# EAGLE design ANEMOMETRO_REED_SWITCH (EAGLE 9.6.2)
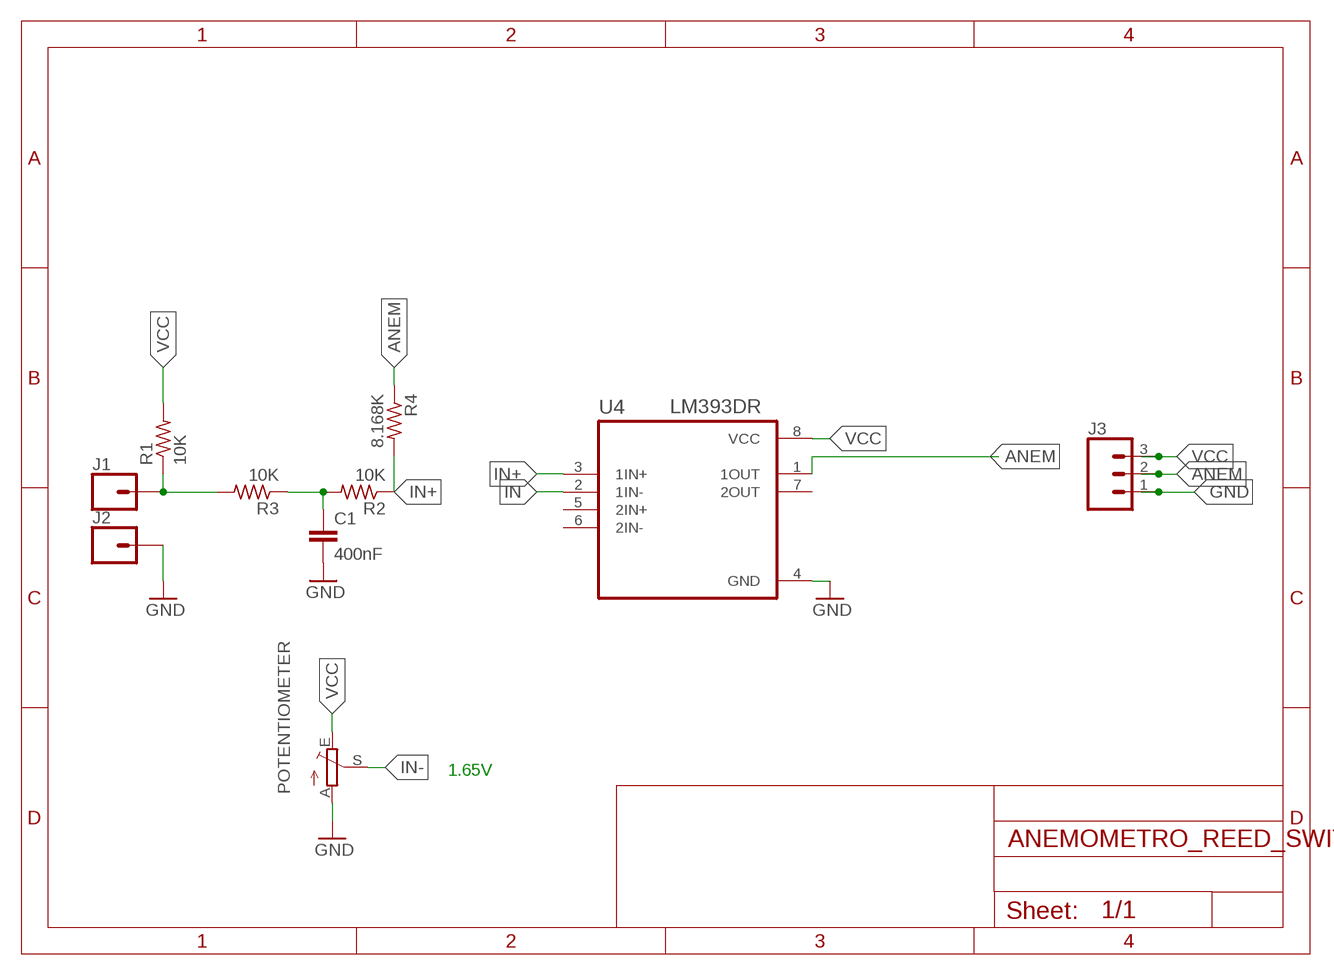
[diagram p0: schematic, sheet 1]

## Parts
C1  400nF  C-EUC0603  [C0603]
J1  CONN_01PTH_NO_SILK_YES_STOP  [1X01_NO_SILK]
J2  CONN_01PTH_NO_SILK_YES_STOP  [1X01_NO_SILK]
J3  CONN_03JST-PTH-VERT  [JST-3-PTH-VERT]
POTENTIOMETER  TRIM_EU-S64W  [S64W]
R1  10K  R-US_R0603  [R0603]
R2  10K  R-US_R0603  [R0603]
R3  10K  R-US_R0603  [R0603]
R4  8.168K  R-US_R0603  [R0603]
U4  LM393DR  [SOIC127P599X175-8N]

## Nets
ANEM: J3.2 R4.1 U4.1(1OUT)
GND [GND]: C1.2 J2.1 J3.1 POTENTIOMETER.A U4.4(GND)
IN: U4.2(1IN-)
IN+: R2.1 R4.2 U4.3(1IN+)
IN-: POTENTIOMETER.S
N$1: C1.1 R2.2 R3.1
N$3: J1.1 R1.1 R3.2
VCC: J3.3 POTENTIOMETER.E R1.2 U4.8(VCC)
Unconnected: U4.5(2IN+) U4.6(2IN-) U4.7(2OUT)

## Notes on the sheet
- 1.65V

## Library data of the parts
C1 = rcl:C-EU: CAPACITOR, European symbol; SPICEPREFIX: C
J1 J2 = SparkFun-Connectors:CONN_01: Single connection point. Often used as Generic Header-pin footprint for 0.1 inch spaced/style header connections On any of the 0.1 inch spaced packages, you can populate with these: Break Away Headers - Straight <https://www.sparkfun.com/products/116> (PRT-00116) Break Away Male Headers - Right Angle <https://www.sparkfun.com/products/553> (PRT-00553) Female Headers <https://www.sparkfun.com/products/115> (PRT-00115) Break Away Headers - Machine Pin <https://www.sparkfun.com/products/117> (PRT-00117) Break Away Female Headers - Swiss Machine Pin <https://www.sparkfun.com/products/743> (PRT-00743) This device is also useful as a general connection point to wire up your design to another part of your project. Our various solder wires solder well into these plated through hole pads. Hook-Up Wire - Assortment (Stranded, 22 AWG) <https://www.sparkfun.com/products/11375> (PRT-11375) Hook-Up Wire - Assortment (Solid Core, 22 AWG) <https://www.sparkfun.com/products/11367> (PRT-11367) View the entire wire category on our website here <https://www.sparkfun.com/categories/141> Special notes: SMTSO-256-ET is a "flush mount" nut for a 4-40 screw. We mostly use this on specialty testbeds; it is a nice way to connect hardware to your PCB at an adjustable hieght. Also note, the SNAP packages are for using a snappable style connector. We sell a baggie of snaps and they are also used on two LilyPad designs: Snap Assortment - 30 pack (male and female) <https://www.sparkfun.com/products/11347> (DEV-11347) LilyPad Arduino SimpleSnap <https://www.sparkfun.com/products/10941> (DEV-10941) LilyPad SimpleSnap Protoboard <https://www.sparkfun.com/products/10940> (DEV-10940)
J3 = SparkFun-Connectors:CONN_03: Multi connection point. Often used as Generic Header-pin footprint for 0.1 inch spaced/style header connections On any of the 0.1 inch spaced packages, you can populate with these: Break Away Headers - Straight <https://www.sparkfun.com/products/116> (PRT-00116) Break Away Male Headers - Right Angle <https://www.sparkfun.com/products/553> (PRT-00553) Female Headers <https://www.sparkfun.com/products/115> (PRT-00115) Break Away Headers - Machine Pin <https://www.sparkfun.com/products/117> (PRT-00117) Break Away Female Headers - Swiss Machine Pin <https://www.sparkfun.com/products/743> (PRT-00743) Stackable Header - 3 Pin (Female, 0.1") <https://www.sparkfun.com/products/13875> (PRT-13875) For SCREWTERMINALS and SPRING TERMINALS visit here: Screw Terimnals on SparkFun.com <https://www.sparkfun.com/search/results?term=Screw+Terminals> (5mm/3.5mm/2.54mm spacing) This device is also useful as a general connection point to wire up your design to another part of your project. Our various solder wires solder well into these plated through hole pads. Hook-Up Wire - Assortment (Stranded, 22 AWG) <https://www.sparkfun.com/products/11375> (PRT-11375) Hook-Up Wire - Assortment (Solid Core, 22 AWG) <https://www.sparkfun.com/products/11367> (PRT-11367) View the entire wire category on our website here <https://www.sparkfun.com/categories/141> Special notes: Molex polarized connector foot print use with SKU : PRT-08232 with associated crimp pins and housings.; PROD_ID: CONN-13230
POTENTIOMETER = pot:TRIM_EU-: POTENTIOMETER
R1-R4 = rcl:R-US_: RESISTOR, American symbol; SPICEPREFIX: R
U4 = LM393DR:LM393DR: Check prices <https://pricing.snapeda.com/parts/LM393DR/Texas%20Instruments/view-part?ref=eda>; AVAILABILITY: In Stock; DESCRIPTION: Dual differential comparator, commercial grade 8-SOIC 0 to 70; MF: Texas Instruments; MP: LM393DR; PACKAGE: SOIC-8 Texas Instruments; PRICE: None; PURCHASE-URL: https://pricing.snapeda.com/search/part/LM393DR/?ref=eda

## Net classes
1 GND: width 0.4 mm

## Board
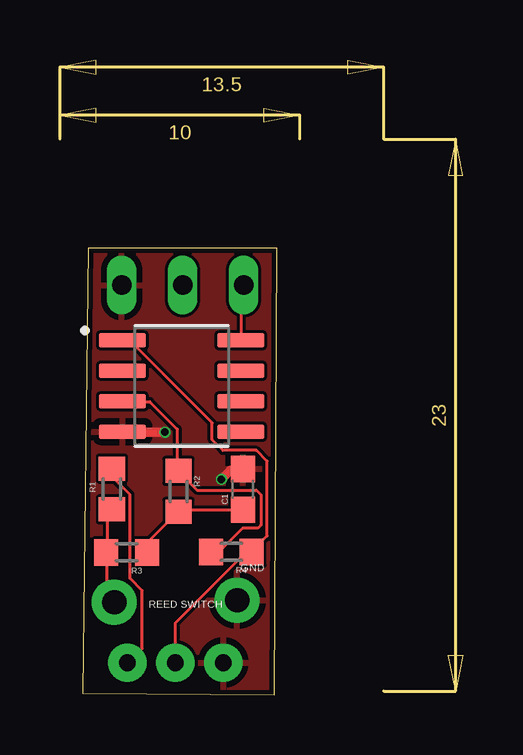
[diagram p1: board, top side]
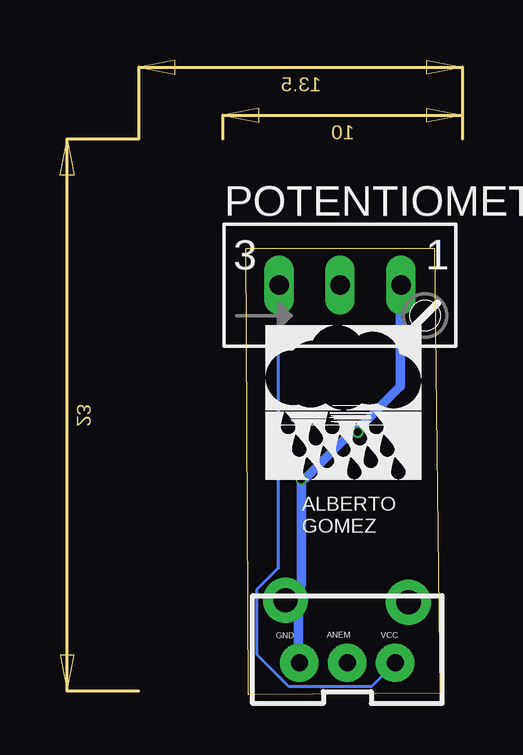
[diagram p2: board, bottom side, seen from below]

Size 8.09 x 18.62 mm. Coordinates in mm from the lower left corner, seen from the top.
Outline: 0,0.07 7.99,0 8.09,18.61 0.23,18.62 0,0.07
Copper layers (1*16): Top 0.035559375mm / dielectric 1.6mm / Bottom 0.035559375mm
Design rules "jlcpcb2layer": minimum track width 5mil, minimum drill 12mil, track to track 5mil, track to pad 5mil, pad to pad 5mil, via to via 5mil, smd to smd 5mil, copper to edge 8mil, drill to drill 6mil, minimum pad ring 5mil, minimum via ring 3mil, stop-mask expansion 2.5mil, vias tented up to drill 0mil, thermal gap 10mil

### Footprints (pad centres in the part's own frame; a part is rotated, then mirrored left to right if it is on the bottom)
C0603 = smd 1.1 x 1: 1 -0.85,0; 2 0.85,0
1X01_NO_SILK = drill 1.016 pad 1.88: 1 0,0
JST-3-PTH-VERT = drill 0.7 pad 1.6: 1 -2,-0.55; 2 0,-0.55; 3 2,-0.55
S64W = drill 0.813 long: A 2.54,1.27; E -2.54,1.27; S 0,1.27
R0603 = smd 1 x 1.1: 1 -0.85,0; 2 0.85,0
SOIC127P599X175-8N = smd 1.97 x 0.6: 1 -2.47,1.905; 2 -2.47,0.635; 3 -2.47,-0.635; 4 -2.47,-1.905; 5 2.47,-1.905; 6 2.47,-0.635; 7 2.47,0.635; 8 2.47,1.905

### Placement (x,y rotation side)
C1  6.69,8.57 90 top
J1  1.31,3.87 0 top
J2  6.44,3.95 0 top
J3  3.86,1.89 0 bottom
POTENTIOMETER  4.17,15.81 0 bottom
R1  1.21,8.58 90 top
R2  3.99,8.48 270 top
R3  1.83,5.94 180 top
R4  6.19,5.96 180 top
U4  4.12,12.88 0 top

### Tracks (layer width: path | path; a pad name or v marks a point on that pad's centre or on a via)
ANEM
  Top 0.127: J3.2 3.87,1.36 3.87,3.01 6.79,5.94 6.98,5.94 R4.1 7.05,6 7.68,6.63 7.68,9.74 7.24,10.19 5.84,10.19 5.39,10.63 5.39,11.33 1.97,14.76 1.71,14.76 U4.1
GND  (via drill 0.3)
  Top 0.4: v5.78,8.98 6.16,9.36 6.67,9.36 C1.2 | v3.43,10.95 1.71,10.95 U4.4
  Bottom 0.4: POTENTIOMETER.A 1.65,17.05 1.65,12.86 3.36,11.14 v3.43,10.95 3.68,10.95 5.58,9.05 v5.78,8.98 5.78,4.6 6.41,3.97 J2.1 6.35,3.78 5.9,3.33 5.9,1.36 J3.1
  pour Top: 0.25,18.59 7.82,18.59 7.98,18.43 7.98,0.06 7.95,0.03 0.03,0.03 -0.04,-0.03 -0.04,18.3 0.22,18.56
IN+
  Top 0.127: U4.3 1.71,12.22 2.79,12.22 3.93,11.08 3.93,9.36 R2.1 4,9.3 4.76,8.54 7.24,8.54 7.43,8.35 7.43,7.08 7.3,6.95 6.67,6.95 5.71,6 5.39,6 R4.2
N$1
  Top 0.127: R3.1 2.73,6 2.73,6.38 3.93,7.59 R2.2 4,7.65 4.06,7.71 6.67,7.71 C1.1
N$3
  Top 0.127: R1.1 1.2,7.71 1.01,7.52 1.01,6 R3.2 1.01,5.94 1.01,4.16 1.27,3.9 J1.1
VCC
  Top 0.127: U4.8 6.6,14.82 6.6,16.98 6.67,17.05 POTENTIOMETER.E | R1.2 1.27,9.43 1.27,9.05 1.97,8.35 1.97,4.86 2.47,4.35 2.47,1.94 1.9,1.36 J3.3
  Bottom 0.127: POTENTIOMETER.E 6.73,17.05 6.73,5.3 7.62,4.41 7.62,1.68 6.28,0.35 2.85,0.35 1.9,1.3 J3.3

### Text on the board
tPlace: GND | REED SWITCH
bPlace: ALBERTO / GOMEZ | VCC | ANEM | GND
tOrigins: D:/projectos/projecto estacion meteorologica/definitivo.bmp